# EAGLE design ReDevelo_rev_A (EAGLE 9.6.2)
PC Engine Joypad Breakout Version 1.0
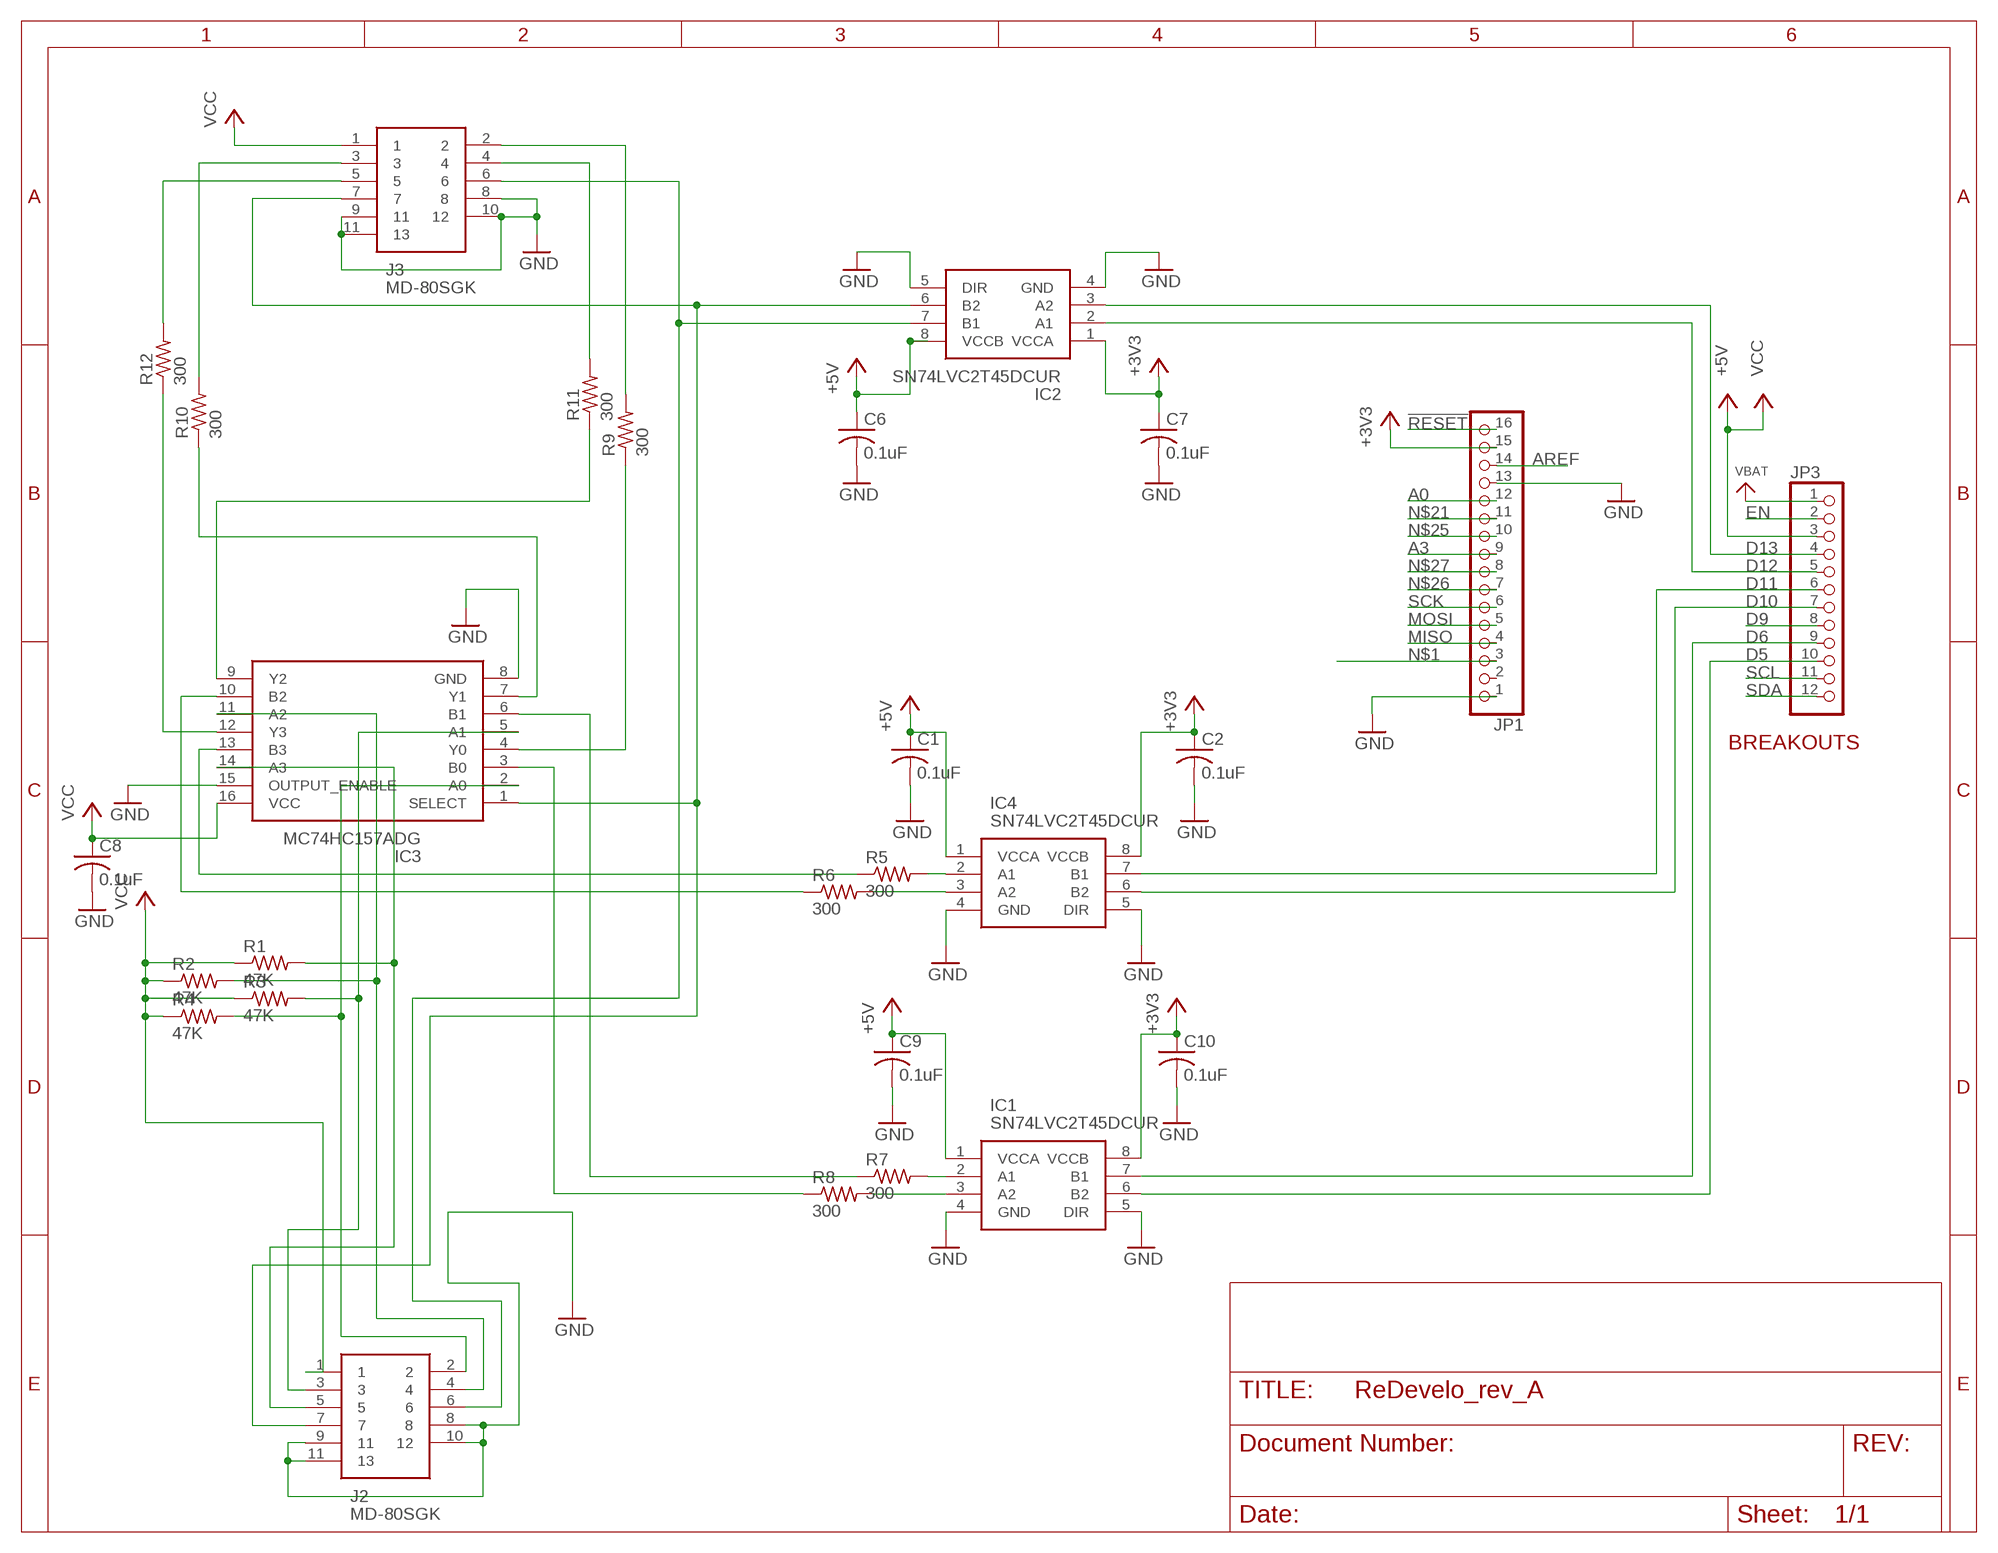
[diagram p0: schematic, sheet 1]

## Parts
C1  0.1uF  C-USC0603  [C0603]
C2  0.1uF  C-USC0603  [C0603]
C6  0.1uF  C-USC0603  [C0603]
C7  0.1uF  C-USC0603  [C0603]
C8  0.1uF  C-USC0603  [C0603]
C9  0.1uF  C-USC0603  [C0603]
C10  0.1uF  C-USC0603  [C0603]
IC1  SN74LVC2T45DCUR  [SOP50P310X90-8N]
IC2  SN74LVC2T45DCUR  [SOP50P310X90-8N]
IC3  MC74HC157ADG  [SOIC127P600X175-16N]
IC4  SN74LVC2T45DCUR  [SOP50P310X90-8N]
J2  MD-80SGK  [MD80SGK]
J3  MD-80SGK  [MD80SGK]
JP1  HEADER-1X16ROUND  [1X16_ROUND]
JP3  HEADER-1X12  [1X12_ROUND]
R1  47K  R-US_R0603  [R0603]
R2  47K  R-US_R0603  [R0603]
R3  47K  R-US_R0603  [R0603]
R4  47K  R-US_R0603  [R0603]
R5  300  R-US_R0603  [R0603]
R6  300  R-US_R0603  [R0603]
R7  300  R-US_R0603  [R0603]
R8  300  R-US_R0603  [R0603]
R9  300  R-US_R0603  [R0603]
R10  300  R-US_R0603  [R0603]
R11  300  R-US_R0603  [R0603]
R12  300  R-US_R0603  [R0603]

## Nets
!RESET: JP1.16
+3V3 [power]: C2.1 C7.1 C10.1 IC1.8(VCCB) IC2.1(VCCA) IC4.8(VCCB) JP1.15
A0: JP1.12
A3: JP1.9
AREF: JP1.14
D5 [signal]: IC1.6(B2) JP3.10
D6: IC1.7(B1) JP3.9
D9: JP3.8
D10 [signal]: IC4.6(B2) JP3.7
D11 [signal]: IC4.7(B1) JP3.6
D12: IC2.2(A1) JP3.5
D13 [signal]: IC2.3(A2) JP3.4
EN: JP3.2
GND: C1.2 C2.2 C6.2 C7.2 C8.2 C9.2 C10.2 IC1.4(GND) IC1.5(DIR) IC2.4(GND) IC2.5(DIR) IC3.8(GND) IC3.15(OUTPUT_ENABLE) IC4.4(GND) IC4.5(DIR) J2.8 J2.9 J2.10 J2.11 J3.8 J3.9 J3.10 J3.11 JP1.1 JP1.13
MISO: JP1.4
MOSI: JP1.5
N$1: JP1.3
N$2 [signal]: IC3.5(A1) J2.3 R3.2
N$3 [signal]: IC3.2(A0) J2.2 R4.2
N$4 [signal]: IC3.11(A2) J2.4 R2.2
N$5 [signal]: IC3.14(A3) J2.5 R1.2
N$6 [signal]: IC2.7(B1) J2.6 J3.6
N$7 [signal]: IC2.6(B2) IC3.1(SELECT) J2.7 J3.7
N$8: IC3.12(Y3) R12.1
N$9: IC3.9(Y2) R11.1
N$10: IC3.13(B3) R5.1
N$11: IC3.7(Y1) R10.1
N$12: IC4.2(A1) R5.2
N$13: IC4.3(A2) R6.2
N$14: IC1.3(A2) R8.2
N$15: IC1.2(A1) R7.2
N$16: IC3.10(B2) R6.1
N$17: IC3.3(B0) R8.1
N$18: IC3.6(B1) R7.1
N$19: J3.2 R9.2
N$20: J3.4 R11.2
N$21: JP1.11
N$22: IC3.4(Y0) R9.1
N$23: J3.3 R10.2
N$24: J3.5 R12.2
N$25: JP1.10
N$26: JP1.7
N$27: JP1.8
SCK: JP1.6
SCL: JP3.11
SDA: JP3.12
VBAT: JP3.1
VCC [power]: C1.1 C6.1 C8.1 C9.1 IC1.1(VCCA) IC2.8(VCCB) IC3.16(VCC) IC4.1(VCCA) J2.1 J3.1 JP3.3 R1.1 R2.1 R3.1 R4.1 ; supply symbol labelled +5V
Unconnected: JP1.2

## Notes on the sheet
- BREAKOUTS

## Library data of the parts
C1 C2 C6-C10 = resistor:C-US: CAPACITOR, American symbol
IC1 IC2 IC4 = PC-Engine:SN74LVC2T45DCUR: Texas Instruments SN74LVC2T45DCUR, Voltage Level Translator, Bus Transceiver, 3-State, 1.65 5.5 V, 8-Pin UM Source: Datasheet <http://www.ti.com/lit/gpn/sn74lvc2t45>; ARROW_PART_NUMBER: SN74LVC2T45DCUR; ARROW_PRICE-STOCK: https://www.arrow.com/en/products/sn74lvc2t45dcur/texas-instruments?region=nac; DESCRIPTION: Texas Instruments SN74LVC2T45DCUR, Voltage Level Translator, Bus Transceiver, 3-State, 1.65 5.5 V, 8-Pin UM; HEIGHT: 0.9mm; MANUFACTURER_NAME: Texas Instruments; MANUFACTURER_PART_NUMBER: SN74LVC2T45DCUR; MOUSER_PART_NUMBER: 595-SN74LVC2T45DCUR; MOUSER_PRICE-STOCK: https://www.mouser.co.uk/ProductDetail/Texas-Instruments/SN74LVC2T45DCUR?qs=0smPjiIwnfIdG9vxyJHBdA%3D%3D
IC3 = PC-Engine:MC74HC157ADG: Source: Datasheet <http://www.onsemi.com/pub/Collateral/MC74HC157A-D.PDF>; ALLIED_NUMBER: 70466365; ALLIED_PRICE-STOCK: http://www.alliedelec.com/on-semiconductor-mc74hc157adg/70466365/; HEIGHT: 1.75mm; MANUFACTURER_NAME: ON Semiconductor; MANUFACTURER_PART_NUMBER: MC74HC157ADG; MOUSER_PART_NUMBER: 863-MC74HC157ADG; MOUSER_PRICE-STOCK: https://www.mouser.com/Search/Refine.aspx?Keyword=863-MC74HC157ADG; RS_PART_NUMBER: 8061422P; RS_PRICE-STOCK: http://uk.rs-online.com/web/p/products/8061422P
J2 J3 = SamacSys_Parts:MD-80SGK: Circular DIN Connectors mini-DIN, 8P jack, rt, through hole, full shield Source: Datasheet <https://www.cui.com/product/resource/md-sgk-series.pdf>; DESCRIPTION: Circular DIN Connectors mini-DIN, 8P jack, rt, through hole, full shield; HEIGHT: 13mm; MANUFACTURER_NAME: CUI; MANUFACTURER_PART_NUMBER: MD-80SGK; MOUSER_PART_NUMBER: 490-MD-80SGK; MOUSER_PRICE-STOCK: https://www.mouser.com/Search/Refine.aspx?Keyword=490-MD-80SGK
JP1 = microbuilder:HEADER-1X16: PIN HEADER
JP3 = microbuilder:HEADER-1X12
R1-R12 = resistor:R-US_: RESISTOR, American symbol

## Net classes
0 default: width 0.152 mm, drill 0.356 mm, clearance 0.152 mm
1 power: width 0.305 mm, drill 0.356 mm, clearance 0.152 mm
2 signal: width 0.152 mm, drill 0.356 mm, clearance 0.152 mm

## Board
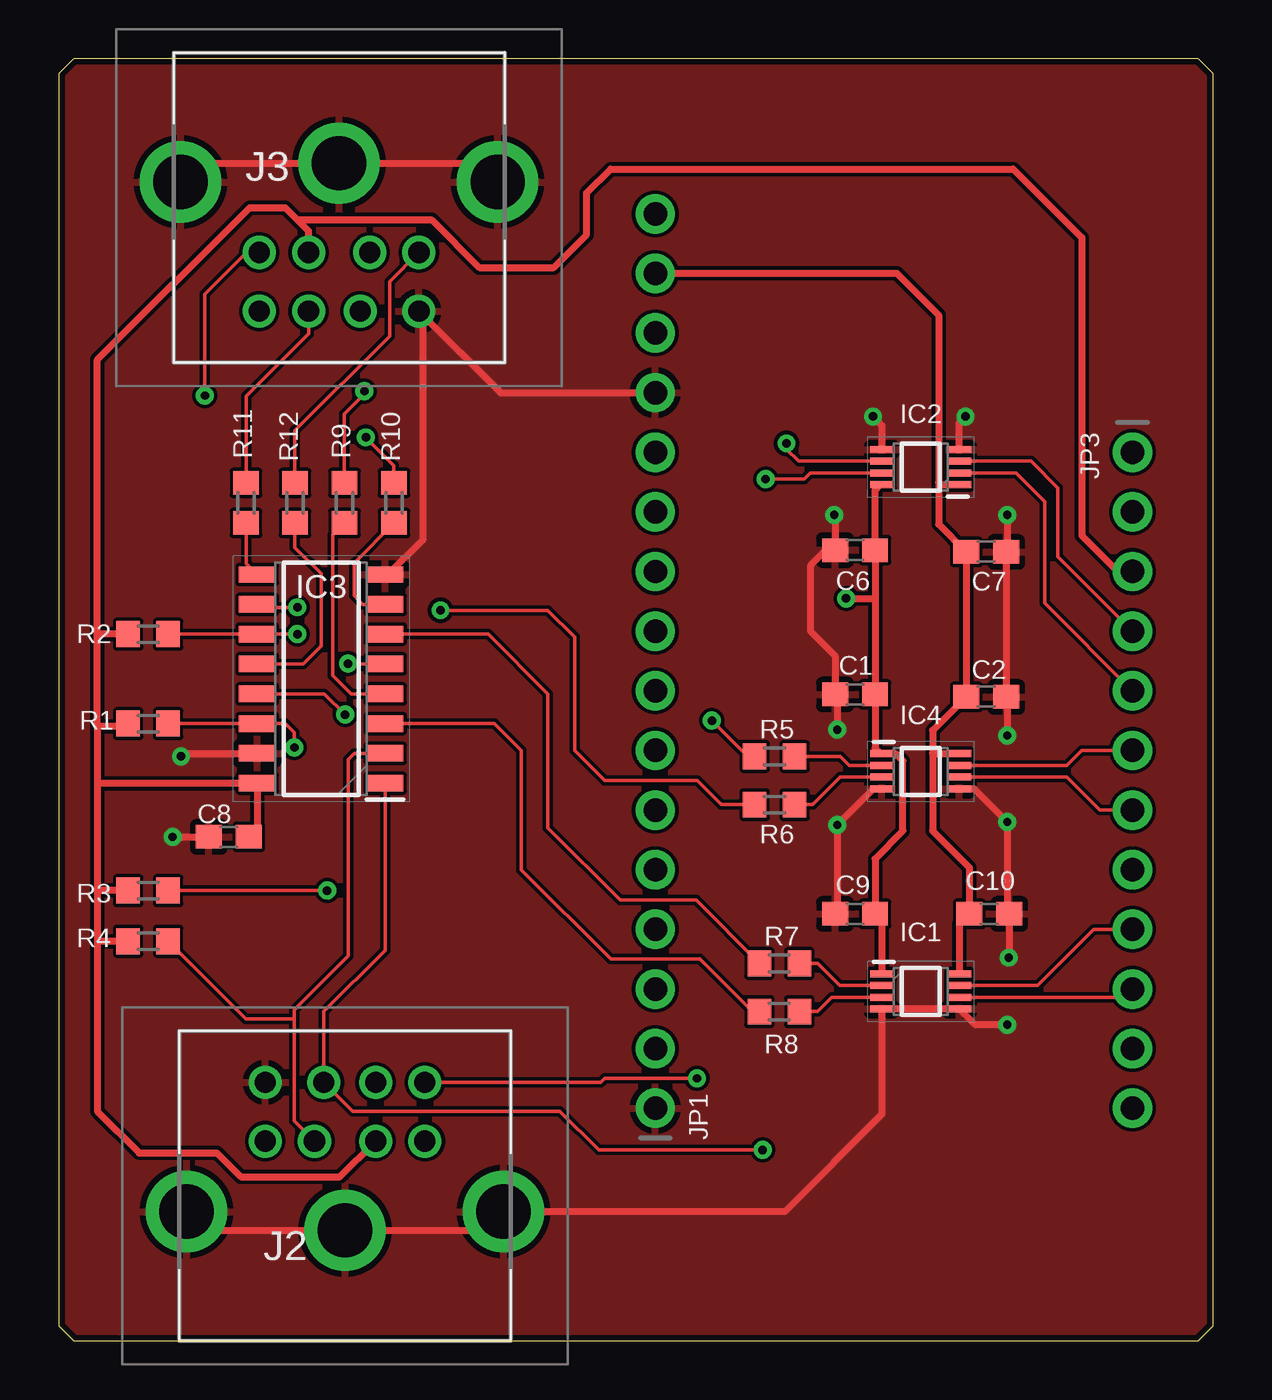
[diagram p1: board, top side]
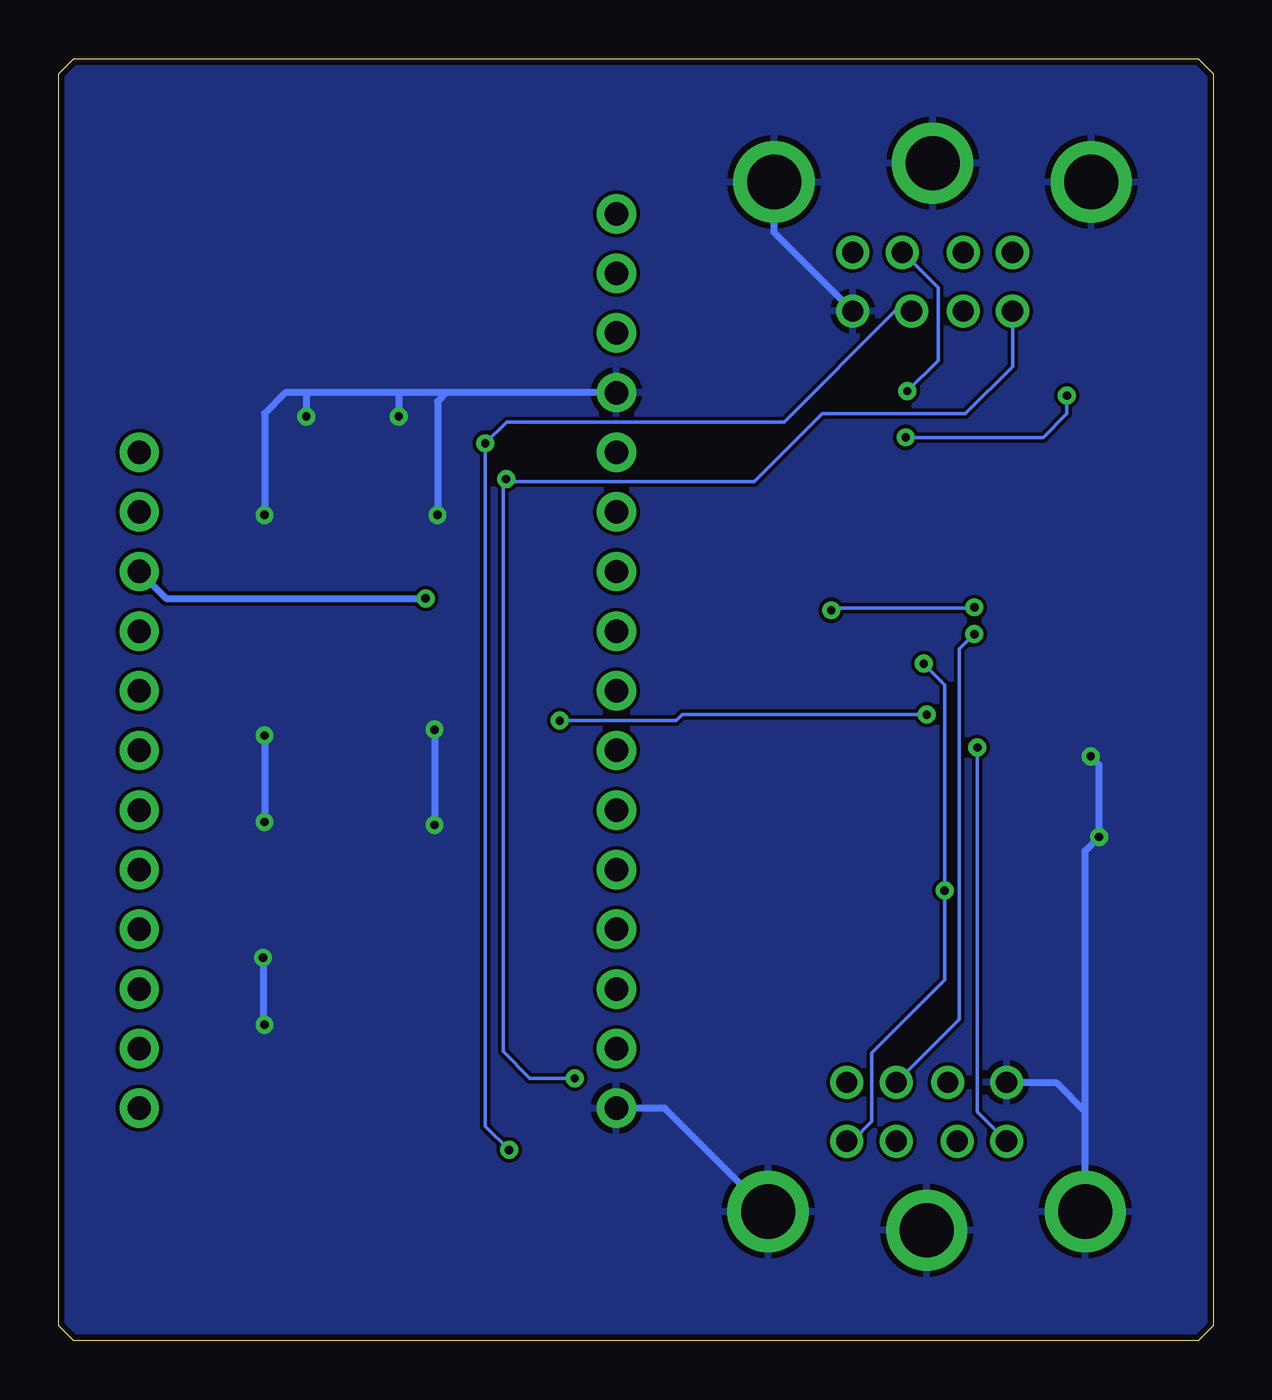
[diagram p2: board, bottom side, seen from below]

Size 49.15 x 54.61 mm. Coordinates in mm from the lower left corner, seen from the top.
Outline: 48.51,54.61 0.64,54.61 0,53.98 0,0.64 0.64,0 48.51,0 49.15,0.64 49.15,53.98 48.51,54.61
Copper layers (1*16): Top 0.035mm / dielectric 1.5mm / Bottom 0.035mm
Design rules "default *": minimum track width 6mil, minimum drill 0.35mm, track to track 6mil, track to pad 6mil, pad to pad 6mil, via to via 6mil, smd to smd 6mil, copper to edge 10mil, drill to drill 6mil, minimum pad ring 10mil, minimum via ring 8mil, stop-mask expansion 6mil, vias tented up to drill 15mil, thermal gap 10mil

### Footprints (pad centres in the part's own frame; a part is rotated, then mirrored left to right if it is on the bottom)
C0603 = smd 1.1 x 1: 1 -0.85,0; 2 0.85,0
SOP50P310X90-8N = smd 1 x 0.3: 1 -1.65,0.75; 2 -1.65,0.25; 3 -1.65,-0.25; 4 -1.65,-0.75; 5 1.65,-0.75; 6 1.65,-0.25; 7 1.65,0.25; 8 1.65,0.75
SOIC127P600X175-16N = smd 1.55 x 0.7: 1 -2.725,4.445; 2 -2.725,3.175; 3 -2.725,1.905; 4 -2.725,0.635; 5 -2.725,-0.635; 6 -2.725,-1.905; 7 -2.725,-3.175; 8 -2.725,-4.445; 9 2.725,-4.445; 10 2.725,-3.175; 11 2.725,-1.905; 12 2.725,-0.635; 13 2.725,0.635; 14 2.725,1.905; 15 2.725,3.175; 16 2.725,4.445
MD80SGK = drill 0.9 pad 1.4: 1 -1.3,-1.9; 2 1.3,-1.9; 3 -3.4,-1.9; 4 -1.3,-4.4; 5 3.4,-1.9; 6 -3.4,-4.4; 7 0.9,-4.4; 8 3.4,-4.4 | drill 2.309 pad 3.463: 9 0,1.9; 10 -6.75,1.1; 11 6.75,1.1
1X16_ROUND = drill 1 pad 1.676: 1 -19.05,0; 2 -16.51,0; 3 -13.97,0; 4 -11.43,0; 5 -8.89,0; 6 -6.35,0; 7 -3.81,0; 8 -1.27,0; 9 1.27,0; 10 3.81,0; 11 6.35,0; 12 8.89,0; 13 11.43,0; 14 13.97,0; 15 16.51,0; 16 19.05,0
1X12_ROUND = drill 1 pad 1.676: 1 -13.97,0; 2 -11.43,0; 3 -8.89,0; 4 -6.35,0; 5 -3.81,0; 6 -1.27,0; 7 1.27,0; 8 3.81,0; 9 6.35,0; 10 8.89,0; 11 11.43,0; 12 13.97,0
R0603 = smd 1 x 1.1: 1 -0.85,0; 2 0.85,0

### Placement (x,y rotation side)
C1  33.91,27.53 180 top
C2  39.5,27.43 0 top
C6  33.91,33.68 180 top
C7  39.5,33.6 0 top
C8  7.24,21.46 180 top
C9  33.91,18.19 180 top
C10  39.62,18.19 0 top
IC1  36.7,14.88 0 top
IC2  36.7,37.21 180 top
IC3  11.18,28.19 180 top
IC4  36.7,24.26 0 top
J2  12.19,6.6 180 top
J3  11.94,48.26 0 top
JP1  25.4,28.96 90 top
JP3  45.72,23.88 270 top
R1  3.81,26.29 0 top
R2  3.81,30.1 0 top
R3  3.81,19.18 0 top
R4  3.81,17.02 0 top
R5  30.48,24.89 0 top
R6  30.48,22.83 0 top
R7  30.68,16.08 0 top
R8  30.68,14.02 0 top
R9  12.17,35.69 90 top
R10  14.27,35.69 90 top
R11  7.98,35.69 90 top
R12  10.06,35.69 90 top

### Tracks (layer width: path | path; a pad name or v marks a point on that pad's centre or on a via)
+3V3
  Top 0.305: JP1.15 35.69,45.47 37.47,43.69 37.47,36.58 | 37.47,36.58 37.58,36.46 IC2.1 | 37.47,36.58 37.47,34.79 C7.1 C2.1 37.21,26 37.21,25.02 | 37.21,25.02 37.21,21.72 38.77,20.15 C10.1 38.35,17.77 IC1.8 | 37.21,25.02 IC4.8
D5
  Top 0.152: IC1.6 45.37,14.63 JP3.10
D6
  Top 0.152: JP3.9 44.07,17.53 41.68,15.13 IC1.7
D10
  Top 0.152: JP3.7 44.32,22.61 42.92,24.01 IC4.6
D11
  Top 0.152: JP3.6 43.56,25.15 42.92,24.51 IC4.7
D12
  Top 0.152: JP3.5 41.99,31.42 41.99,35.74 40.76,36.96 IC2.2
D13
  Top 0.152: JP3.4 42.55,33.4 42.55,36.32 41.4,37.47 IC2.3
GND  (via drill 0.36)
  Top 0.305: J2.11 6.24,4.7 J2.9 18.14,4.7 J2.10 30.9,5.5 35.05,9.65 IC1.4 IC1.5 39.02,13.46 v40.39,13.46 | J3.10 5.99,50.16 J3.9 17.89,50.16 J3.11 | IC3.8 14.02,32.64 15.49,34.11 15.49,43.71 J3.8 18.81,40.39 JP1.13 | v40.39,35.18 40.39,33.64 C7.2 C2.2 40.39,27.39 v40.39,25.78 | v33.02,35.18 33.06,35.14 C6.2 33.03,33.66 32.64,33.66 32,33.02 32,30.23 33.06,29.17 C1.2 33.15,27.45 v33.15,26.04 | v40.45,16.32 40.51,16.38 40.47,16.42 C10.2 40.39,18.27 v40.39,22.1 38.98,23.51 IC4.5 | C9.2 33.15,18.27 v33.15,21.97 34.68,23.51 IC4.4 | v34.67,39.37 35.05,38.99 IC2.5 | IC2.4 38.35,39.12 v38.61,39.37 | v4.85,21.46 C8.2 | v5.21,24.89 5.33,25.02 IC3.15
  Bottom 0.305: J3.8 18.69,47.21 J3.11 | JP1.13 32.64,40.39 | 32.64,40.39 34.67,40.39 | 34.67,40.39 38.61,40.39 | 38.61,40.39 39.5,40.39 40.39,39.5 v40.39,35.18 | 38.61,40.39 v38.61,39.37 | 34.67,40.39 v34.67,39.37 | v40.39,25.78 v40.39,22.1 | 32.64,40.39 33.02,40.01 v33.02,35.18 | v40.45,16.32 40.45,13.53 v40.39,13.46 | v33.15,26.04 v33.15,21.97 | J2.8 6.69,11 5.44,9.76 | J2.11 5.44,9.76 | 5.44,9.76 5.44,20.87 v4.85,21.46 4.85,24.54 v5.21,24.89 | J2.10 23.34,9.91 JP1.1
  pour Bottom: -0.38,55.37 50.55,55.37 50.55,-0.38 -0.38,-0.38
  pour Top: -1.02,-0.25 -1.02,55.63 51.05,55.63 51.05,-0.51 -0.76,-0.51
N$2  (via drill 0.36)
  Top 0.152: R3.2 v11.43,19.18 | v12.32,28.84 12.33,28.83 IC3.5
  Bottom 0.152: J2.3 15.37,8.5 14.53,9.35 14.53,12.27 11.43,15.37 v11.43,19.18 11.43,27.94 v12.32,28.83 v12.32,28.84
N$3
  Top 0.152: J2.2 10.03,9.36 10.03,13.72 | IC3.2 12.58,25.02 12.32,24.76 12.32,16.39 10.03,14.1 10.03,13.72 | 10.03,13.72 7.96,13.72 R4.2
N$4  (via drill 0.36)
  Top 0.152: R2.2 IC3.11 v10.16,30.1
  Bottom 0.152: J2.4 10.79,13.7 10.79,29.46 v10.16,30.1
N$5  (via drill 0.36)
  Top 0.152: R1.2 IC3.14 9.65,26.29 10.03,25.91 v10.03,25.27
  Bottom 0.152: J2.5 10.03,9.74 v10.03,25.27
N$6  (via drill 0.36)
  Top 0.152: v30.1,36.7 31.75,36.7 32.01,36.96 IC2.7 | J2.6 23.07,11 23.24,11.18 v27.18,11.18
  Bottom 0.152: J3.6 8.54,41.5 10.54,39.5 16.64,39.5 19.53,36.6 30,36.6 v30.1,36.7 30.23,36.58 30.23,12.32 29.08,11.18 v27.18,11.18
N$7  (via drill 0.36)
  Top 0.152: v30.99,38.23 30.99,37.97 31.5,37.46 IC2.6 | v29.97,8.13 22.99,8.13 21.34,9.78 12.52,9.78 J2.7 11.29,14.03 13.9,16.64 IC3.1
  Bottom 0.152: J3.7 13.54,43.86 18.26,39.14 30.07,39.14 v30.99,38.23 30.99,9.14 v29.97,8.13
N$8
  Top 0.152: IC3.12 10.41,28.83 11.18,29.59 11.18,32.68 10.06,33.8 R12.1
N$9
  Top 0.152: IC3.9 7.98,33.11 R11.1
N$10  (via drill 0.36)
  Top 0.152: IC3.13 11.3,27.56 v12.19,26.67 | v27.81,26.42 29.34,24.89 R5.1
  Bottom 0.152: v12.19,26.67 22.61,26.67 22.86,26.42 v27.81,26.42
N$11
  Top 0.152: IC3.7 12.95,31.37 12.57,31.75 12.57,33.13 R10.1
N$12
  Top 0.152: R5.2 33.27,24.89 33.66,24.51 IC4.2
N$13
  Top 0.152: R6.2 32.11,22.84 33.28,24.01 IC4.3
N$14
  Top 0.152: R8.2 32.31,14.02 32.92,14.63 IC1.3
N$15
  Top 0.152: R7.2 32.31,16.08 33.25,15.13 IC1.2
N$16  (via drill 0.36)
  Top 0.152: R6.1 28.22,22.84 27.18,23.88 23.24,23.88 21.97,25.15 21.97,29.97 20.83,31.11 v16.26,31.11 | v10.16,31.24 8.58,31.24 IC3.10
  Bottom 0.152: v16.26,31.11 16.15,31.22 10.19,31.22 v10.16,31.24
N$17
  Top 0.152: R8.1 29.53,14.02 27.29,16.26 23.5,16.26 19.68,20.07 19.68,25.15 18.54,26.29 IC3.3
N$18
  Top 0.152: R7.1 27.14,18.77 23.9,18.77 20.83,21.84 20.83,27.56 18.29,30.1 IC3.6
N$19  (via drill 0.36)
  Top 0.152: R9.2 12.17,39.47 13.08,40.39 v13.02,40.45
  Bottom 0.152: v13.02,40.45 11.71,41.76 11.71,44.86 13.21,46.36 J3.2
N$20
  Top 0.152: R11.2 7.98,40.23 10.64,42.9 J3.4
N$22
  Top 0.152: R9.1 11.66,34.33 11.66,28.35 12.45,27.56 IC3.4
N$23  (via drill 0.36)
  Top 0.152: J3.3 8.01,46.36 6.22,44.58 v6.22,40.26 | R10.2 14.28,37.29 v13.08,38.48
  Bottom 0.152: v13.08,38.48 7.24,38.48 6.22,39.5 v6.22,40.26
N$24
  Top 0.152: J3.5 14.1,45.12 14.1,42.8 10.06,38.76 R12.2
VCC  (via drill 0.36)
  Top 0.305: 1.65,26.16 1.65,23.75 | 1.65,23.75 IC3.16 8.45,21.82 C8.1 | 10.16,47.75 10.64,47.27 J3.1 | 10.16,47.75 9.65,48.26 8.13,48.26 1.65,41.78 1.65,30.1 | 10.16,47.75 15.88,47.75 17.91,45.72 21.08,45.72 22.48,47.12 22.48,48.9 23.5,49.91 40.64,49.91 43.56,46.99 43.56,34.29 45.09,32.77 JP3.3 | 34.76,31.62 C6.1 34.76,36.23 34.99,36.46 IC2.8 | 34.76,31.62 C1.1 34.76,25.24 34.99,25.01 IC4.1 35.63,25.01 35.94,24.7 35.94,21.72 34.76,20.54 C9.1 35.05,17.89 IC1.1 | v33.53,31.62 34.76,31.62 | 1.65,23.75 1.65,19.3 | 1.65,19.3 1.65,17.02 | 1.65,17.02 1.65,9.78 3.43,8 6.73,8 7.75,6.99 11.97,6.99 J2.1 | R1.1 2.83,26.16 1.65,26.16 | 1.65,26.16 1.65,30.1 | R2.1 1.65,30.1 | R3.1 1.78,19.18 1.65,19.3 | R4.1 1.65,17.02
  Bottom 0.305: JP3.3 44.58,31.62 v33.53,31.62

### Text on the board
tValues: ReDevelo MCU, rev. A | (C)2022 David Shadoff
bValues: JLCJLCJLCJLC